# EasyEDA Pro project ProPrj_Multi-Puporse Circuit System_2026-03-19.epro, board PCB1
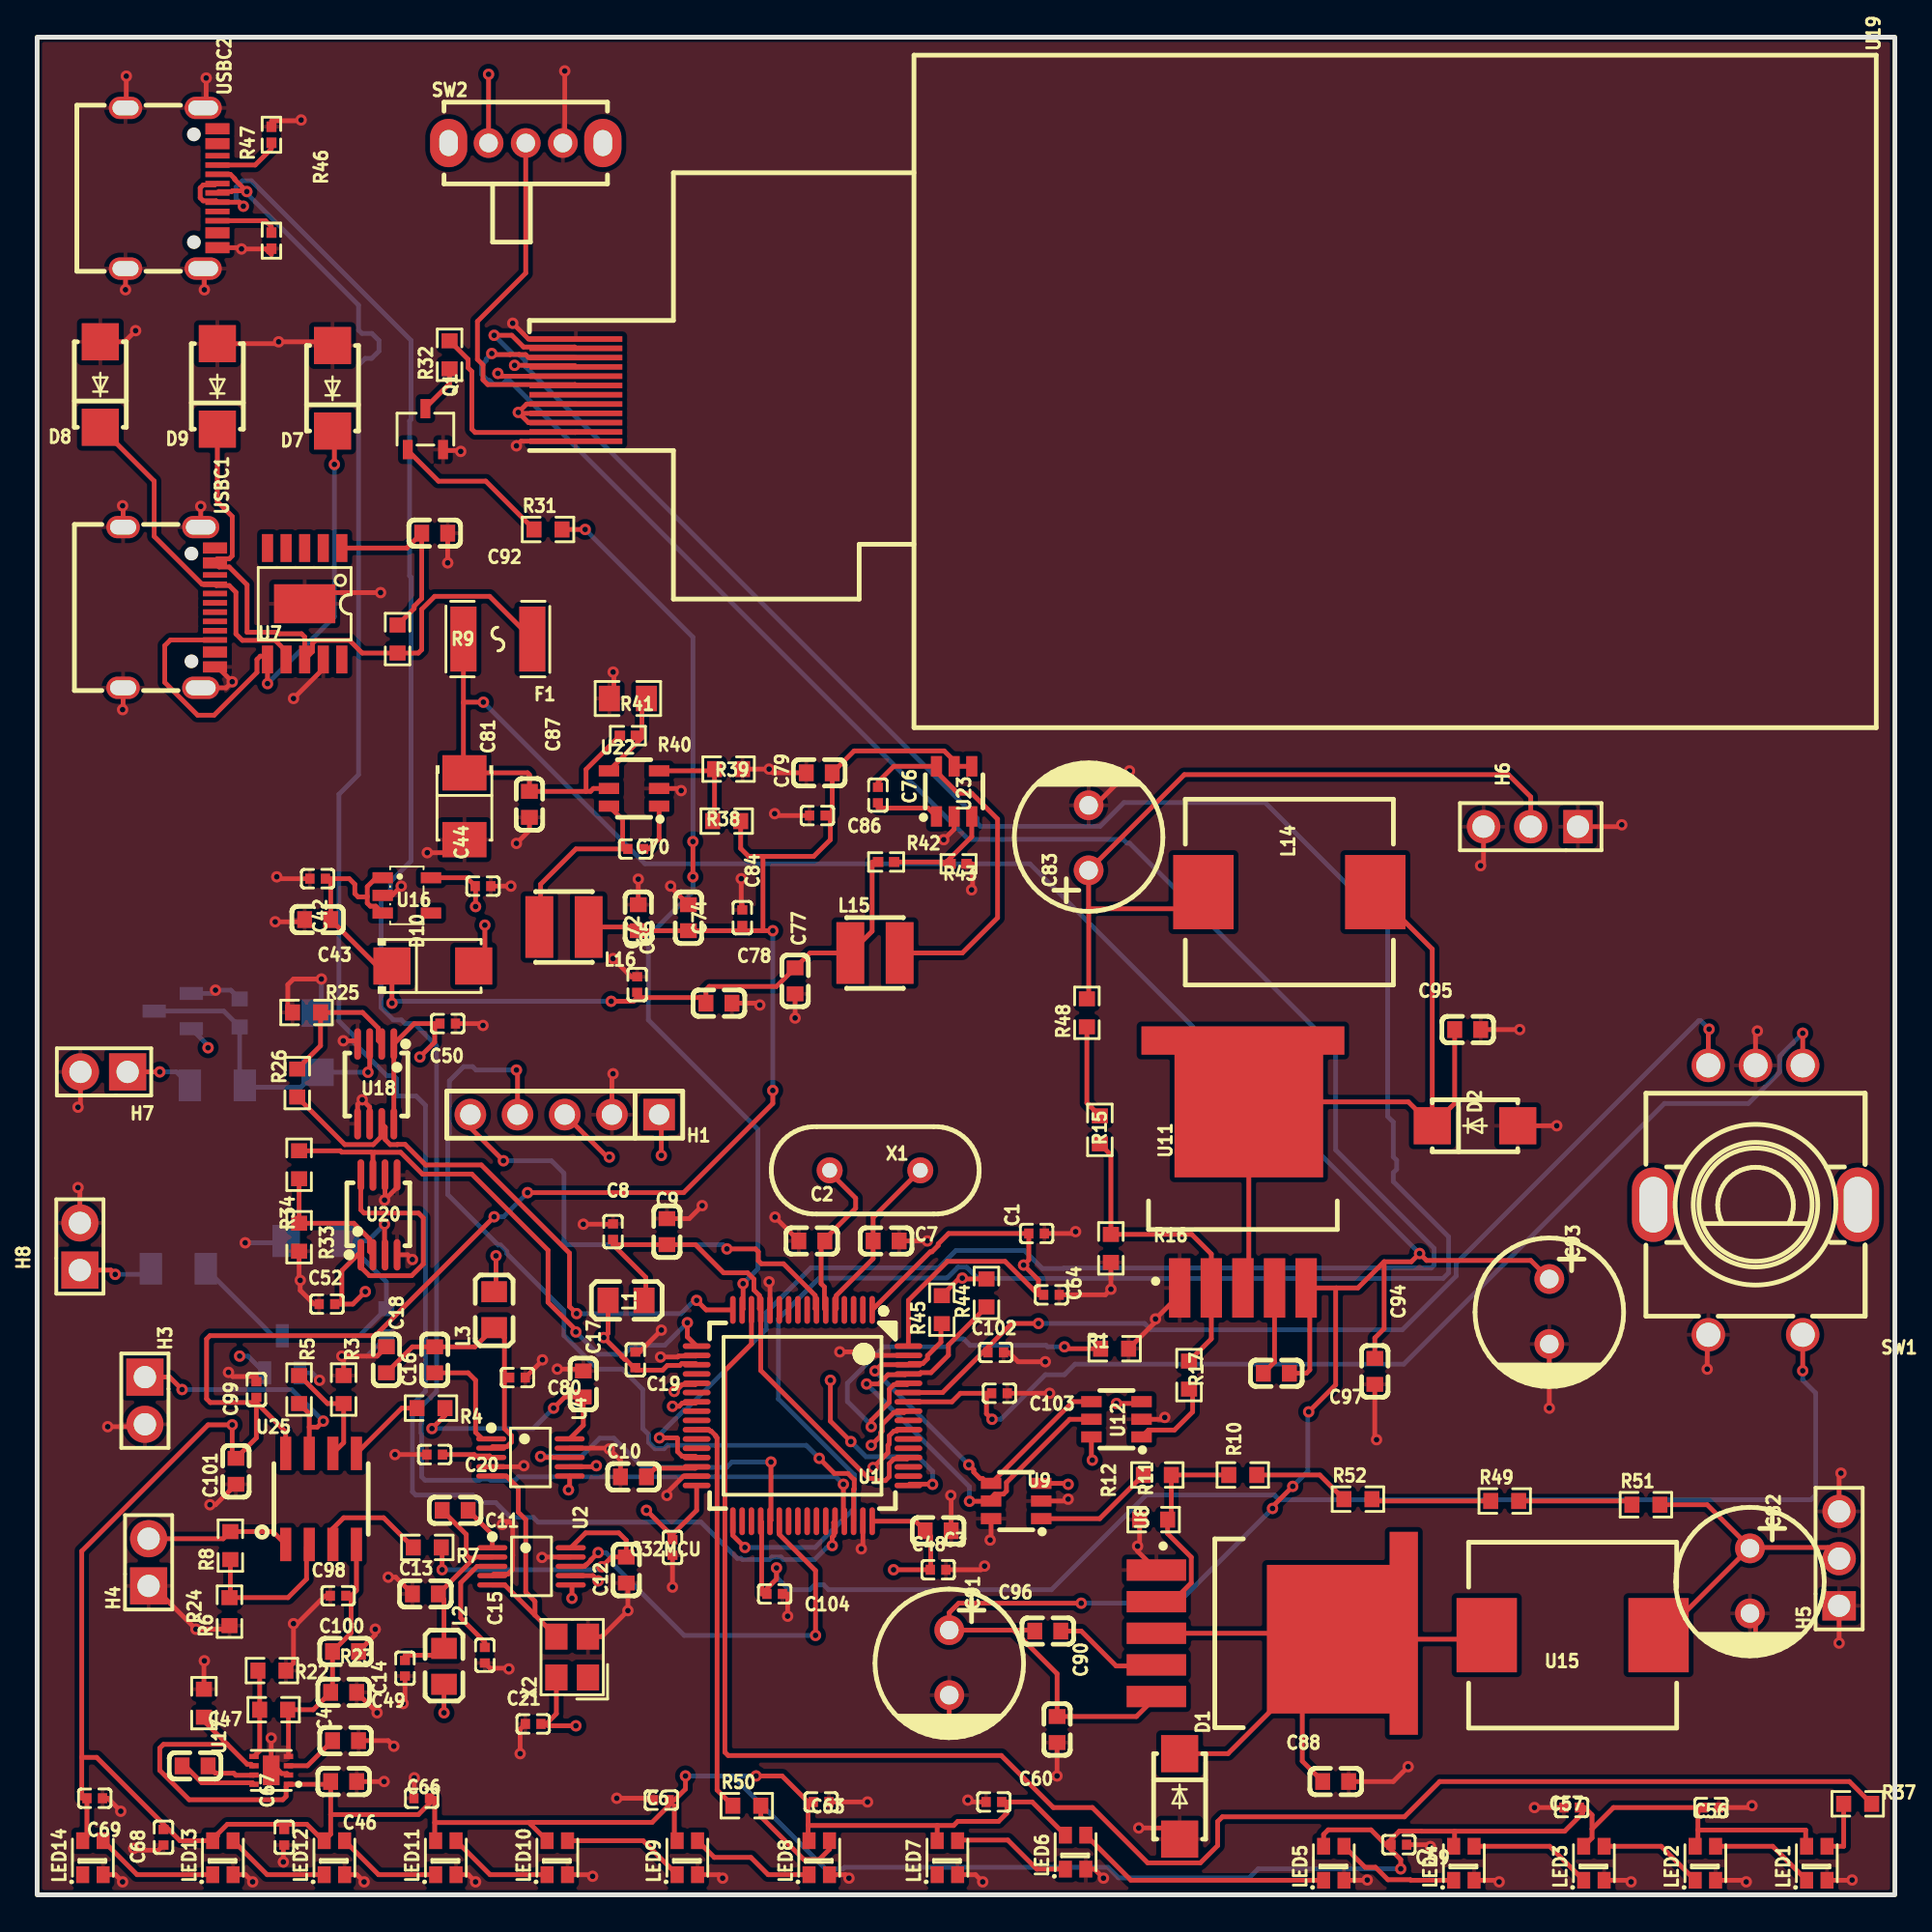
[diagram p1: board, top side]
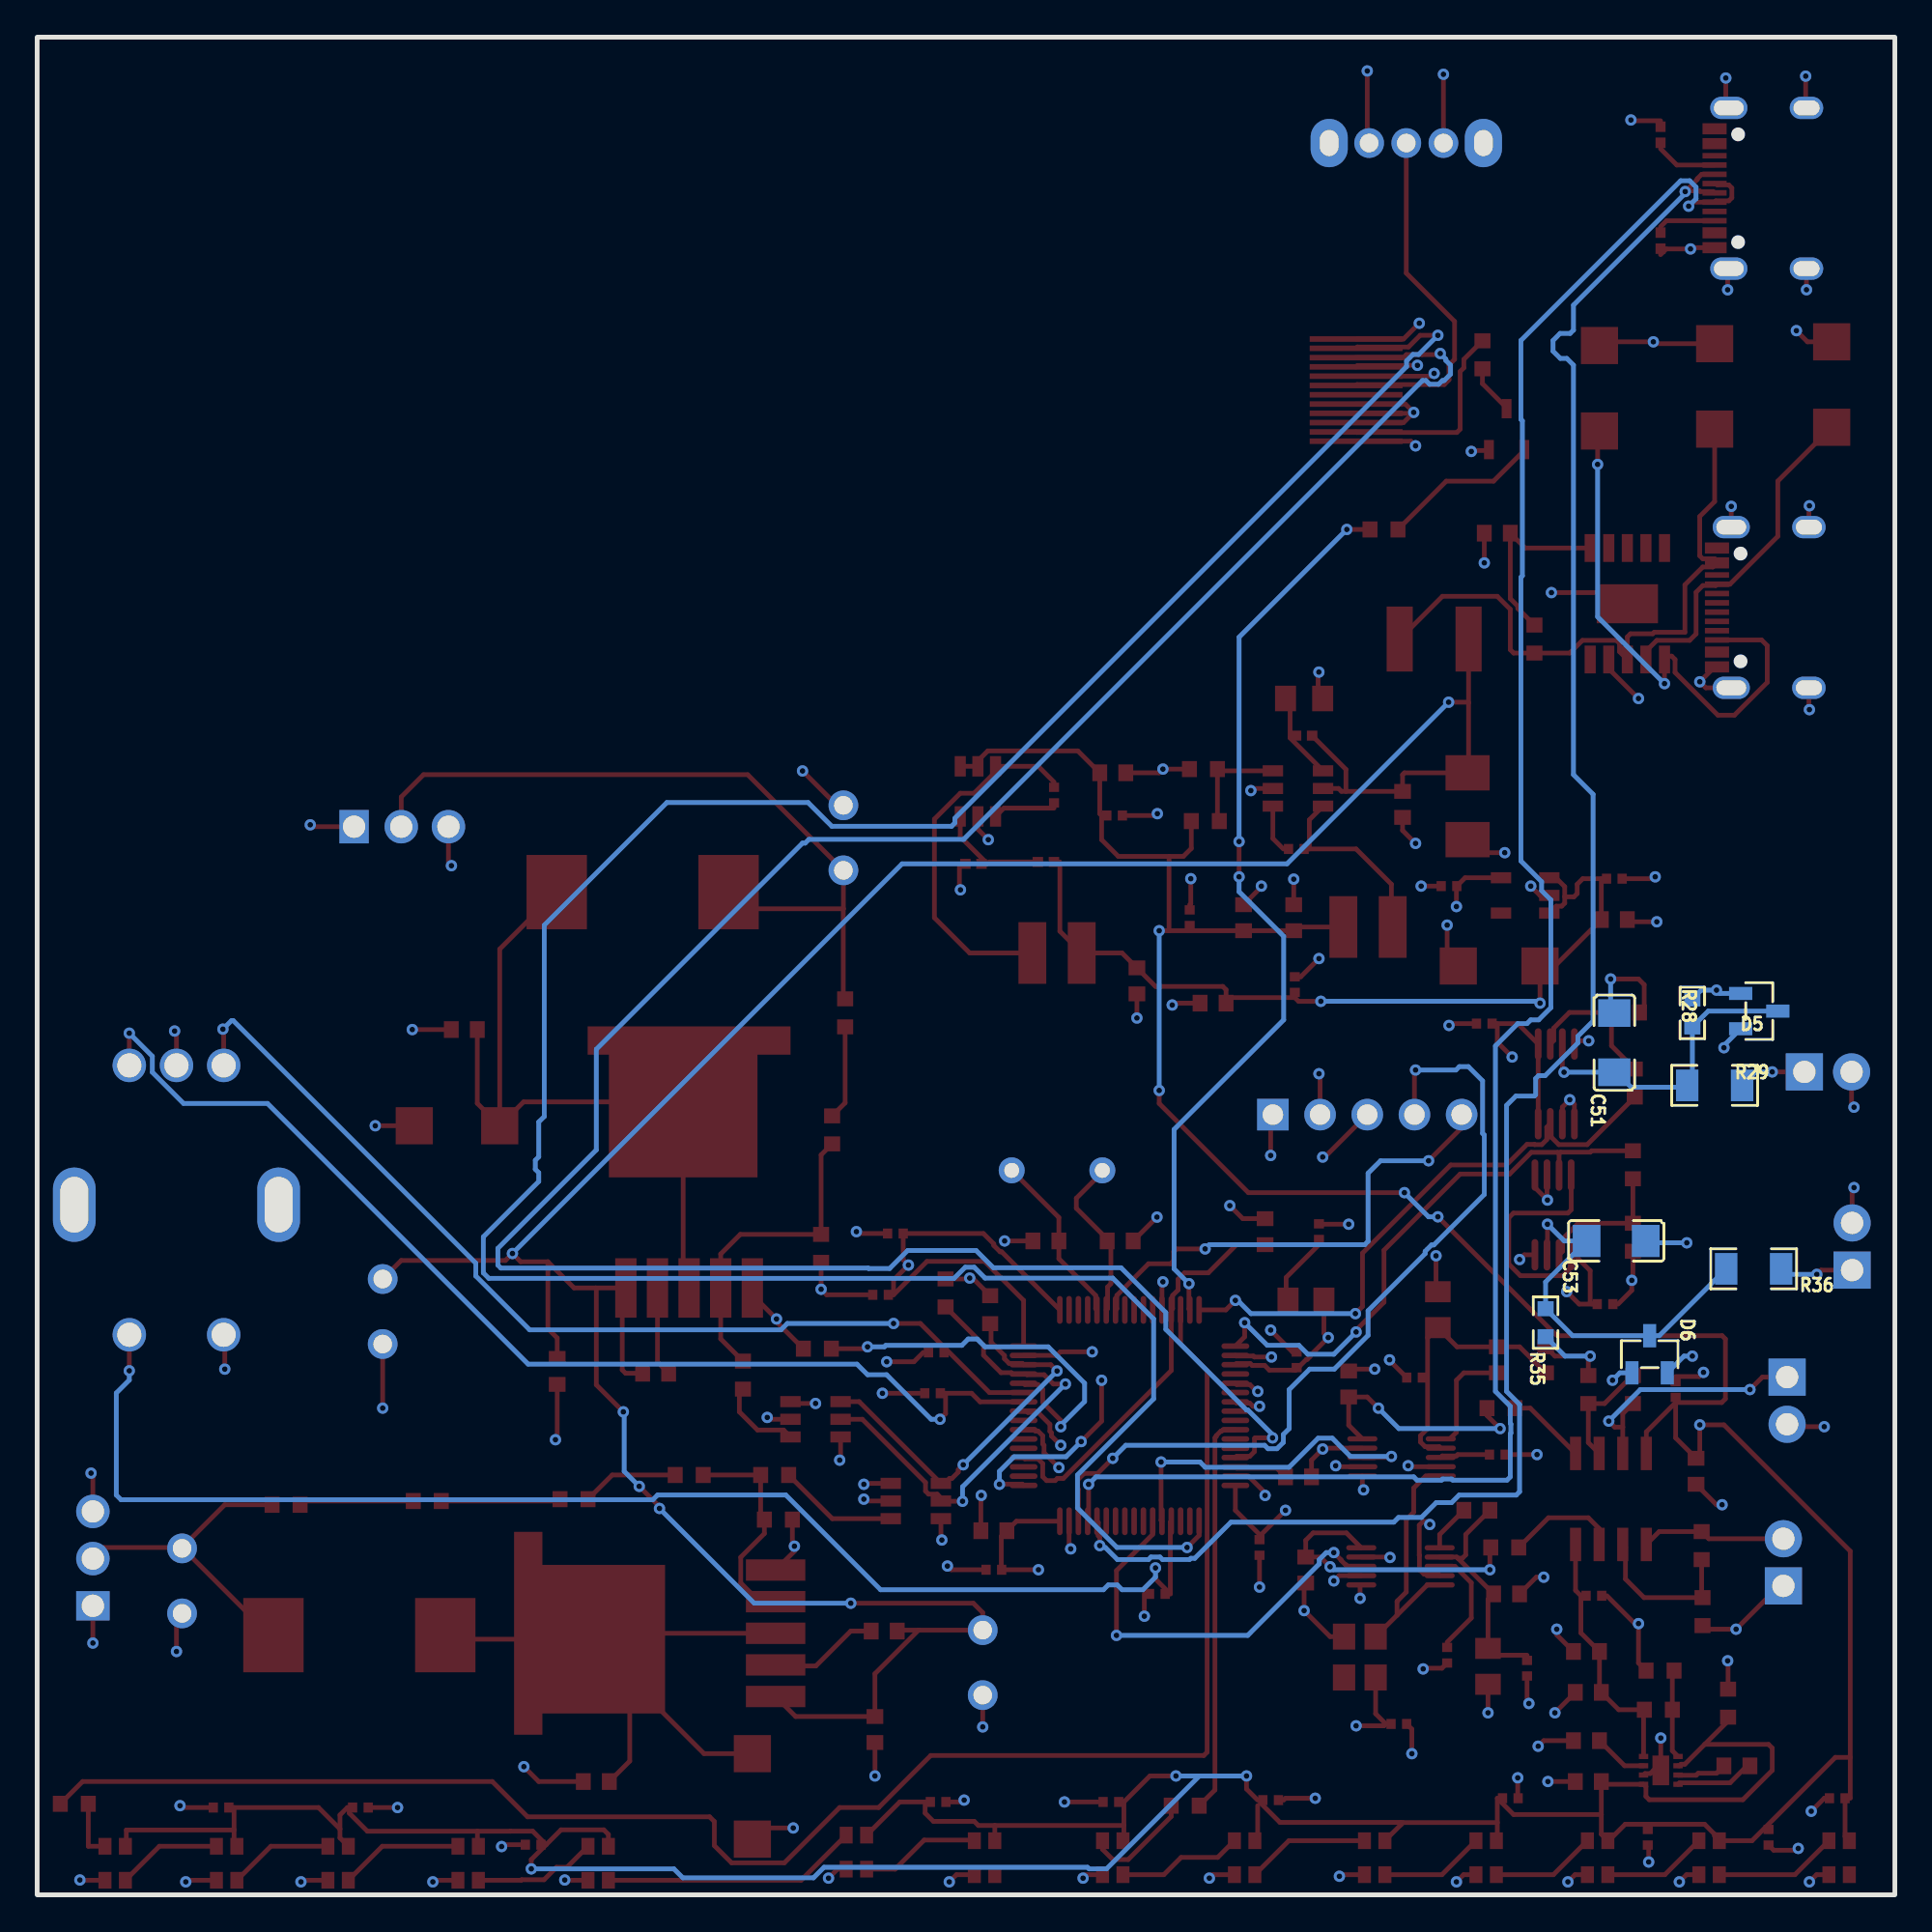
[diagram p2: board, bottom side, seen from below]

Outline 100 x 100 mm; copper layers: Top Layer, Inner1, Inner2, Bottom Layer. Coordinates in mm from the lower left corner of the outline.
Outline path: rectangle 0,0 100,100
Stack: Top Layer 0.035mm Outer layer thickness 1oz / Dielectric1 0.2104mm 7628 RC49% 8.6mil / Inner1 0.0152mm Inner layer thickness / Dielectric2 1.065mm 1.1mm H/HOZ Copper / Inner2 0.0152mm Inner layer thickness / Dielectric3 0.2104mm 7628 RC49% 8.6mil / Bottom Layer 0.035mm Outer layer thickness 1oz

## Design rules (mm)
template: 自定义配置
spacing copperThickness1oz (default): track to track 0.152, other pairs 0.152 to 0.3
spacing copperThickness2oz: track to track 0.203, other pairs 0.152 to 0.3
track width copperThickness1oz (default): min 0.127, default 0.254, max 2.54
track width copperThickness2oz: min 0.203, default 0.254, max 2.54
differential pair differentialPair (default): width min 0.127, default 0.254, max 2.54; gap min 0.152, default 0.152
via viaSize (default): diameter min 0.5, default 0.61, max 10; hole min 0.3, default 0.305, max 6.3

## Placement (name value [footprint] x y rotation side)
C1  100nF  [C0402]  53.8 35.6 0 top
C2  22pF  [C0603]  41.7 35.2 0 top
C3  4.7uF  [C0603]  48.5 19.6 180 top
C4  4.7uF  [C0603]  16.6 8.3 180 top
C6  100nF  [C0402]  33.6 5.1 0 top
C7  22pF  [C0603]  45.7 35.2 180 top
C8  100nF  [C0402]  31 35.7 90 top
C9  1uF  [C0603]  33.9 35.7 90 top
C10  2.2uF  [C0603]  32.1 22.5 0 top
C11  10nF  [C0603]  22.5 20.7 180 top
C12  22pF  [C0603]  31.71 17.48 90 top
C13  10uF  [C0603]  20.9 16.2 0 top
C14  100nF  [C0402]  19.8 12.2 90 top
C15  100nF  [C0402]  24.1 12.9 270 top
C16  10nF  [C0603]  21.4 28.8 90 top
C17  22pF  [C0603]  29.4 27.5 270 top
C18  10uF  [C0603]  18.8 28.8 270 top
C19  100nF  [C0402]  32.2 28.8 90 top
C20  100nF  [C0402]  21.4 23.7 180 top
C21  100nF  [C0402]  26.7 9.2 0 top
C32MCU  100nF  [C0402]  34.2 18.7 270 top
C42  100nF  [C0402]  15.1 54.7 180 top
C43  1uF  [C0603]  15.1 52.5 180 top
C44  1uF  [C0402]  24 54.3 0 top
C46  4.7uF  [C0603]  16.5 6.1 180 top
C47  1uF  [C0603]  8.5 6.94 0 top
C48  100nF  [C0402]  48.5 17.5 0 top
C49  2.2uF  [C0603]  16.5 10.9 180 top
C50  100nF  [C0402]  22.1 46.9 180 top
C51  100nF  [C1206]  15.1 45.87 90 bottom
C52  100nF  [C0402]  15.6 31.8 0 top
C53  100nF  [C1206]  15 35.2 180 bottom
C56  100nF  [C0402]  90.1 4.7 180 top
C57  100nF  [C0402]  82.6 4.7 0 top
C59  100nF  [C0402]  73.3 2.7 180 top
C60  100nF  [C0402]  51.5 5 0 top
C63  100nF  [C0402]  42.2 5 180 top
C64  100nF  [C0402]  54.6 32.3 0 top
C66  100nF  [C0402]  20.7 5.2 0 top
C67  100nF  [C0402]  13.3 3.1 90 top
C68  100nF  [C0402]  6.8 3.1 90 top
C69  100nF  [C0402]  3.1 5.2 180 top
C70  100nF  [C0402]  32.22 56.3 0 top
C72  22pF  [C0603]  32.36 52.6 90 top
C74  22uF  [C0603]  35.06 52.6 270 top
C76  100nF  [C0402]  45.26 59.2 270 top
C77  22pF  [C0603]  40.8 49.2 270 top
C78  22uF  [C0603]  36.7 48 180 top
C79  4.7uF  [C0603]  42.1 60.4 180 top
C80  100nF  [C0402]  25.85 27.85 180 top
C81  4.7uF  [CAP-SMD_L3.5-W2.8-FD]  23 58.6 270 top
C82  330uF  [CAP-TH_BD8.0-P3.50-D0.6-FD]  92.2 16.9 270 top
C83  330uF  [CAP-TH_BD8.0-P3.50-D0.6-FD]  56.6 56.9 90 top
C84  100nF  [C0402]  37.96 52.6 270 top
C85  100nF  [C0402]  32.3 49 270 top
C86  100nF  [C0402]  42 58.1 180 top
C87  100nF  [C0603]  26.5 58.7 270 top
C88  1uF  [C0603]  69.9 6.1 0 top
C90  1uF  [C0603]  54.9 8.9 270 top
C91  220uF  [CAP-TH_BD8.0-P3.50-D0.6-FD]  49.1 12.5 270 top
C92  1uF  [C0603]  21.4 73.3 180 top
C93  220uF  [CAP-TH_BD8.0-P3.50-D0.6-FD]  81.4 31.4 270 top
C94  1uF  [C0603]  72.01 28.18 270 top
C95  1uF  [C0603]  77.01 46.58 0 top
C96  1uF  [C0603]  54.4 14.2 0 top
C97  1uF  [C0603]  66.71 28.08 180 top
C98  100nF  [C0402]  16.2 16.1 0 top
C99  100nF  [C0402]  11.8 27.2 90 top
C100  4.7uF  [C0603]  16.6 13.1 0 top
C101  4.7uF  [C0603]  10.7 22.8 90 top
C102  100nF  [C0402]  51.6 29.2 0 top
C103  100nF  [C0402]  51.8 27 180 top
C104  100nF  [C0402]  39.7 16.2 180 top
D1  B250AF-13  [DO-214AC_L4.3-W2.7-LS5.3-RD]  61.5 5.3 270 top
D2  B250AF-13  [DO-214AC_L4.3-W2.7-LS5.3-RD]  77.4 41.4 0 top
D5  BAV99  [SOT-23-3_L2.9-W1.3-P1.90-LS2.4-BR]  7.3 47.57 0 bottom
D6  BAV99  [SOT-23-3_L2.9-W1.3-P1.90-LS2.4-BR]  13.2 29.1 270 bottom
D7  B250AF-13  [DO-214AC_L4.3-W2.7-LS5.3-RD]  15.9 81.1 90 top
D8  B250AF-13  [DO-214AC_L4.3-W2.7-LS5.3-RD]  3.4 81.3 90 top
D9  B250AF-13  [DO-214AC_L4.3-W2.7-LS5.3-RD]  9.7 81.2 90 top
D10  SS14  [SMA_L4.3-W2.6-LS5.1-RD]  21.3 50 0 top
F1  JK-MSMD110-24V  [F1812]  24.8 67.6 180 top
H1  2.54-1*5  [HDR-TH_5P-P2.54-V-M]  28.4 42 180 top
H3  HX PH254-01-02-Z-L11.5 male header connector  [HDR-TH_2P-P2.54-V-M]  5.8 26.6 270 top
H4  HX PH254-01-02-Z-L11.5 male header connector  [HDR-TH_2P-P2.54-V-M]  6 17.9 90 top
H5  HX PH254-01-03-Z-L11.5 pcb pin header  [HDR-TH_3P-P2.54-V-M-1]  97 18.1 90 top
H6  HX PH254-01-03-Z-L11.5 pcb pin header  [HDR-TH_3P-P2.54-V-M-1]  80.4 57.5 180 top
H7  HX PH254-01-02-Z-L11.5 male header connector  [HDR-TH_2P-P2.54-V-M]  3.6 44.3 180 top
H8  HX PH254-01-02-Z-L11.5 male header connector  [HDR-TH_2P-P2.54-V-M]  2.3 34.9 90 top
L1  HCB2012KV-601T20  [L0805]  31.7 32 180 top
L2  HCB2012KV-601T20  [L0805]  21.9 12.3 270 top
L3  HCB2012KV-601T20  [L0805]  24.6 31.5 90 top
L14  47uH  [IND-SMD_L11.0-W10.2_CXP1050]  67.41 53.98 0 top
L15  10uH  [IND-SMD_L3.0-W3.0]  45.1 50.7 0 top
L16  10uH  [IND-SMD_L3.0-W3.0]  28.36 52.1 180 top
LED1  WS2812B-2020  [LED-SMD_4P-L2.0-W2.0-TL_WS2812B-2020]  95.8 1.7 90 top
LED2  WS2812B-2020  [LED-SMD_4P-L2.0-W2.0-TL_WS2812B-2020]  89.8 1.7 90 top
LED3  WS2812B-2020  [LED-SMD_4P-L2.0-W2.0-TL_WS2812B-2020]  83.8 1.7 90 top
LED4  WS2812B-2020  [LED-SMD_4P-L2.0-W2.0-TL_WS2812B-2020]  76.8 1.7 90 top
LED5  WS2812B-2020  [LED-SMD_4P-L2.0-W2.0-TL_WS2812B-2020]  69.8 1.7 90 top
LED6  WS2812B-2020  [LED-SMD_4P-L2.0-W2.0-TL_WS2812B-2020]  55.9 2.3 90 top
LED7  WS2812B-2020  [LED-SMD_4P-L2.0-W2.0-TL_WS2812B-2020]  49 2 90 top
LED8  WS2812B-2020  [LED-SMD_4P-L2.0-W2.0-TL_WS2812B-2020]  42.1 2 90 top
LED9  WS2812B-2020  [LED-SMD_4P-L2.0-W2.0-TL_WS2812B-2020]  35 2 90 top
LED10  WS2812B-2020  [LED-SMD_4P-L2.0-W2.0-TL_WS2812B-2020]  28 2 90 top
LED11  WS2812B-2020  [LED-SMD_4P-L2.0-W2.0-TL_WS2812B-2020]  22 2 90 top
LED12  WS2812B-2020  [LED-SMD_4P-L2.0-W2.0-TL_WS2812B-2020]  16 2 90 top
LED13  WS2812B-2020  [LED-SMD_4P-L2.0-W2.0-TL_WS2812B-2020]  10 2 90 top
LED14  WS2812B-2020  [LED-SMD_4P-L2.0-W2.0-TL_WS2812B-2020]  3 2 90 top
Q1  L2N7002SLLT1G  [SOT-23-3_L3.0-W1.7-P0.95-LS2.9-BR]  20.9 78.9 270 top
R1  10kΩ  [R0603]  58 29.4 0 top
R3  10kΩ  [R0603]  16.5 27.2 270 top
R4  10kΩ  [R0603]  21.2 26.2 180 top
R5  40kΩ  [R0603]  14.1 27.2 270 top
R6  40kΩ  [R0603]  10.35 15.25 90 top
R7  10kΩ  [R0603]  21 18.7 180 top
R8  40kΩ  [R0603]  10.4 18.8 90 top
R9  1kΩ  [R0603]  19.4 67.6 90 top
R10  15kΩ  [R0603]  64.9 22.6 0 top
R11  1.2kΩ  [R0603]  60.1 20.2 0 top
R12  2.2kΩ  [R0603]  60.3 22.6 0 top
R15  15kΩ  [R0603]  57.21 41.18 90 top
R16  1.2kΩ  [R0603]  57.8 34.8 90 top
R17  2.2kΩ  [R0603]  62.01 27.98 90 top
R22  10kΩ  [R0603]  12.73 9.97 0 top
R23  32kΩ  [R0603]  12.64 12.07 180 top
R24  10kΩ  [R0603]  8.98 10.32 270 top
R25  1kΩ  [R0603]  14.5 47.5 0 top
R26  47kΩ  [R0603]  14 43.7 270 top
R28  1MΩ  [R0603]  10.9 47.47 270 bottom
R29  10kΩ  [R1206]  9.7 43.57 0 bottom
R31  1kΩ  [R0603]  27.5 73.5 0 top
R32  10Ω  [R0603]  22.2 82.9 90 top
R33  1kΩ  [R0603]  14.1 35.4 90 top
R34  47kΩ  [R0603]  14.1 39.3 90 top
R35  1MΩ  [R0603]  18.8 30.8 90 bottom
R36  10kΩ  [R1206]  7.6 33.7 0 bottom
R37  100Ω  [R0603]  98 4.9 180 top
R38  73.2kΩ  [R0603]  37.12 57.8 0 top
R39  10kΩ  [R0603]  37.22 60.6 180 top
R40  100kΩ  [R0402]  31.8 62.4 0 top
R41  25kΩ  [R0805]  31.8 64.4 180 top
R42  100kΩ  [R0402]  45.7 55.6 180 top
R43  20kΩ  [R0402]  49.6 55.5 180 top
R44  10kΩ  [R0603]  51.1 32.4 90 top
R45  10kΩ  [R0603]  48.7 31.5 90 top
R46  5.1kΩ  [R0402]  12.61 89.05 270 top
R47  5.1kΩ  [R0402]  12.61 94.75 90 top
R48  0Ω  [R0603]  56.51 47.48 90 top
R49  0Ω  [R0603]  79 21.2 0 top
R50  100Ω  [R0603]  38.2 4.8 0 top
R51  0Ω  [R0603]  86.6 21 0 top
R52  0Ω  [R0603]  71.1 21.3 0 top
SW1  EC11E15244B2  [SW-TH_EC11XXXXXXXX]  92.5 37.4 180 top
SW2  SK12D07VG3  [SW-TH_SK12D07VG3]  26.3 94.3 0 top
U1  STM32F401RET6  [LQFP-64_L10.0-W10.0-P0.50-LS12.0-BL]  41.2 25.8 180 top
U2  AD9833BRMZ-REEL7  [MSOP-10_L3.0-W3.0-P0.50-LS5.0-BL]  26.61 17.68 270 top
U4  AD9833BRMZ-REEL7  [MSOP-10_L3.0-W3.0-P0.50-LS5.0-BL]  26.55 23.55 270 top
U7  CH224K  [ESSOP-10_L4.9-W3.9-P1.0-LS6.0-TL-EP]  14.4 69.5 180 top
U8  XL4015E1  [TO-263-5_L10.2-W8.9-P1.70-TL]  65.26 14.08 0 top
U9  MCP4725A1T-E/CH  [SOT-23-6_L2.9-W1.6-P0.95-LS2.8-BR]  52.7 21.2 0 top
U11  XL4015E1  [TO-263-5_L10.2-W8.9-P1.70-TL]  64.91 37.68 90 top
U12  MCP4725A1T-E/CH  [SOT-23-6_L2.9-W1.6-P0.95-LS2.8-BR]  58.1 25.6 0 top
U15  47uH  [IND-SMD_L11.0-W10.2_CXP1050]  82.66 13.98 180 top
U16  LP5907MFX-3.3  [SOT-23-5_L3.0-W1.7-P0.95-LS2.8-BR]  19.9 53.8 180 top
U17  LM27761DSGR  [WSON-8_L2.0-W2.0-P0.65-BL-EP]  12.6 6.7 90 top
U18  ADCMP602BRMZ  [MSOP-8_L3.0-W3.0-P0.65-LS5.0-BL]  18.22 43.66 180 top
U19  HS20HS072RX  [OLED-SMD_HS20HS072RX]  29 81 270 top
U20  ADCMP602BRMZ  [MSOP-8_L3.0-W3.0-P0.65-LS5.0-BL]  18.4 36.6 0 top
U22  SY8201CABC  [SOT-23-6_L2.9-W1.6-P0.95-LS2.8-BR]  32.13 59.56 0 top
U23  SY8201CABC  [SOT-23-6_L2.9-W1.6-P0.95-LS2.8-BR]  49.36 59.4 270 top
U25  TSH22IDT  [SO-8_L4.9-W3.9-P1.27-LS6.0-BL]  15.28 21.31 0 top
USBC1  TYPE-C-31-M-12  [USB-C_SMD-TYPE-C-31-M-12_1]  7.1 69.3 270 top
USBC2  TYPE-C-31-M-12  [USB-C_SMD-TYPE-C-31-M-12_1]  7.23 91.87 270 top
X1  8MHz  [CRYSTAL-TH_L11.1-W4.7]  45.1 39 0 top
X2  25MHz  [OSC-SMD_4P-L3.2-W2.5-BL-OXETDLJANF-0.032768MHZ]  28.8 12.8 90 top

## Footprints (pads in the part's own frame, mm; a bottom-side part is the same pattern mirrored in y, then rotated)
C0402
  rect 0.5x0.54 smd: 1(-0.42,0) 2(0.42,0)
C0603
  rect 0.8x0.9 smd: 1(-0.7,0) 2(0.7,0)
C1206
  rect 1.485x1.728 smd: 1(-1.593,0) 2(1.593,0)
CAP-SMD_L3.5-W2.8-FD
  rect 1.9x2.376 smd: 1(-1.798,0) 2(1.798,0)
CAP-TH_BD8.0-P3.50-D0.6-FD
  round 1.6 hole 1: 1(-1.75,0) 2(1.75,0)
CRYSTAL-TH_L11.1-W4.7
  round 1.4 hole 0.8: 1(-2.44,0) 2(2.44,0)
DO-214AC_L4.3-W2.7-LS5.3-RD
  rect 2x2 smd: 1(-2.3,0) 2(2.3,0)
ESSOP-10_L4.9-W3.9-P1.0-LS6.0-TL-EP
  rect 0.6x1.5 smd: 1(-2,-3) 2(-1,-3) 3(0,-3) 4(1,-3) 5(2,-3) 6(2,3) 7(1,3) 8(0,3) 9(-1,3) 10(-2,3)
  rect 3.3x2.1 smd: 11(0,0)
F1812
  rect 1.407x3.499 smd: 1(-1.853,0) 2(1.853,0)
HDR-TH_2P-P2.54-V-M
  rect 2x2 hole 1.2: 1(-1.27,0)
  round 2 hole 1.2: 2(1.27,0)
HDR-TH_3P-P2.54-V-M-1
  rect 1.575x1.8 hole 1.2: 1(-2.54,0)
  round 1.8 hole 1.2: 2(0,0) 3(2.54,0)
HDR-TH_5P-P2.54-V-M
  rect 1.7x1.7 hole 1.1: 1(-5.08,0)
  round 1.7 hole 1.1: 2(-2.54,0) 3(0,0) 4(2.54,0) 5(5.08,0)
IND-SMD_L3.0-W3.0
  rect 1.5x3.32 smd: 1(1.328,0) 2(-1.328,0)
IND-SMD_L11.0-W10.2_CXP1050
  rect 3.25x4 smd: 1(-4.625,0) 2(4.625,0)
L0805
  rect 1.133x1.377 smd: 1(-0.966,0) 2(0.966,0)
LED-SMD_4P-L2.0-W2.0-TL_WS2812B-2020
  rect 0.9x0.7 smd: 1(-0.915,0.55) 2(-0.915,-0.55) 3(0.915,-0.55) 4(0.915,0.55)
LQFP-64_L10.0-W10.0-P0.50-LS12.0-BL
  oval 0.3x1.5 smd: 1(-3.75,-5.688) 2(-3.25,-5.688) 3(-2.75,-5.688) 4(-2.25,-5.688) 5(-1.75,-5.688) 6(-1.25,-5.688) 7(-0.75,-5.688) 8(-0.25,-5.688) 9(0.25,-5.688) 10(0.75,-5.688) 11(1.25,-5.688) 12(1.75,-5.688) 13(2.25,-5.688) 14(2.75,-5.688) 15(3.25,-5.688) 16(3.75,-5.688) 33(3.75,5.688) 34(3.25,5.688) 35(2.75,5.688) 36(2.25,5.688) 37(1.75,5.688) 38(1.25,5.688) 39(0.75,5.688) 40(0.25,5.688) 41(-0.25,5.688) 42(-0.75,5.688) 43(-1.25,5.688) 44(-1.75,5.688) 45(-2.25,5.688) 46(-2.75,5.688) 47(-3.25,5.688) 48(-3.75,5.688)
  oval 1.5x0.3 smd: 17(5.7,-3.738) 18(5.7,-3.238) 19(5.7,-2.738) 20(5.7,-2.238) 21(5.7,-1.738) 22(5.7,-1.238) 23(5.7,-0.739) 24(5.7,-0.238) 25(5.7,0.262) 26(5.7,0.762) 27(5.7,1.262) 28(5.7,1.762) 29(5.7,2.261) 30(5.7,2.762) 31(5.7,3.261) 32(5.7,3.762) 49(-5.7,3.762) 50(-5.7,3.261) 51(-5.7,2.762) 52(-5.7,2.261) 53(-5.7,1.762) 54(-5.7,1.262) 55(-5.7,0.762) 56(-5.7,0.262) 57(-5.7,-0.238) 58(-5.7,-0.739) 59(-5.7,-1.238) 60(-5.7,-1.738) 61(-5.7,-2.238) 62(-5.7,-2.738) 63(-5.7,-3.238) 64(-5.7,-3.738)
MSOP-8_L3.0-W3.0-P0.65-LS5.0-BL
  oval 0.364x1.692 smd: 1(-0.975,-2.146) 2(-0.325,-2.146) 3(0.325,-2.146) 4(0.975,-2.146) 5(0.975,2.146) 6(0.325,2.146) 7(-0.325,2.146) 8(-0.975,2.146)
MSOP-10_L3.0-W3.0-P0.50-LS5.0-BL
  oval 0.28x1.62 smd: 1(-1,-2.11) 2(-0.5,-2.11) 3(0,-2.11) 4(0.5,-2.11) 5(1,-2.11) 6(1,2.11) 7(0.5,2.11) 8(0,2.11) 9(-0.5,2.11) 10(-1,2.11)
OLED-SMD_HS20HS072RX
  rect 0.3x5 smd: 1(-2.75,0) 2(-2.25,0) 3(-1.75,0) 4(-1.25,0) 5(-0.75,0) 6(-0.25,0) 7(0.25,0) 8(0.75,0) 9(1.25,0) 10(1.75,0) 11(2.25,0) 12(2.75,0)
OSC-SMD_4P-L3.2-W2.5-BL-OXETDLJANF-0.032768MHZ
  rect 1.4x1.2 smd: 1(-1.1,-0.85) 2(1.1,-0.85) 3(1.1,0.85) 4(-1.1,0.85)
R0402
  rect 0.566x0.54 smd: 1(-0.433,0) 2(0.433,0)
R0603
  rect 0.806x0.864 smd: 1(-0.753,0) 2(0.753,0)
R0805
  rect 1.133x1.377 smd: 1(-1,0) 2(1,0)
R1206
  rect 1.208x1.701 smd: 1(-1.479,0) 2(1.479,0)
SMA_L4.3-W2.6-LS5.1-RD
  rect 2x2 smd: 1(-2.2,0) 2(2.2,0)
SO-8_L4.9-W3.9-P1.27-LS6.0-BL
  rect 0.6x1.8 smd: 1(-1.905,-2.45) 2(-0.635,-2.45) 3(0.635,-2.45) 4(1.905,-2.45) 5(1.905,2.45) 6(0.635,2.45) 7(-0.635,2.45) 8(-1.905,2.45)
SOT-23-3_L2.9-W1.3-P1.90-LS2.4-BR
  rect 1.25x0.7 smd: 1(1,-0.95) 2(1,0.95) 3(-1,0)
SOT-23-3_L3.0-W1.7-P0.95-LS2.9-BR
  rect 1.038x0.532 smd: 1(1.101,-0.95) 2(1.101,0.95) 3(-1.101,0)
SOT-23-5_L3.0-W1.7-P0.95-LS2.8-BR
  rect 1.1x0.6 smd: 1(1.3,-0.95) 2(1.3,0) 3(1.3,0.95) 4(-1.3,0.95) 5(-1.3,-0.95)
SOT-23-6_L2.9-W1.6-P0.95-LS2.8-BR
  rect 1.1x0.6 smd: 1(1.35,-0.95) 2(1.35,0) 3(1.35,0.95) 4(-1.35,0.95) 5(-1.35,0) 6(-1.35,-0.95)
SW-TH_EC11XXXXXXXX
  oval 2.3x4 hole 1.5x3: 6(5.5,0.25) 7(-5.5,0.25)
  round 1.8 hole 1.3: A(-2.54,-7.25) B(2.54,-7.25) C(0,-7.25) D(-2.54,7.25) E(2.54,7.25)
SW-TH_SK12D07VG3
  oval 1.6x1.6 hole 1: 1(-2,0) 2(0,0) 3(2,0)
  oval 2x2.6 hole 1x1.4: 4(4.15,0) 5(-4.15,0)
TO-263-5_L10.2-W8.9-P1.70-TL
  rect 3.2x1.15 smd: 1(-5.008,3.404) 2(-5.008,1.702) 3(-5.008,0) 4(-5.008,-1.702) 5(-5.008,-3.404)
  custom 8.128x10.922 smd: 6(5.008,-0.318)
USB-C_SMD-TYPE-C-31-M-12_1
  oval 1.2x2 hole 0.8x1.6: 1(4.325,1.706) 4(-4.325,1.706)
  oval 1.2x1.8 hole 0.8x1.4: 2(4.325,-2.474) 3(-4.325,-2.474)
  custom 0.6x1.3 smd: A1B12(-3.2,2.474) A4B9(-2.4,2.474) B1A12(3.2,2.474) B4A9(2.401,2.474)
  rect 0.3x1.3 smd: A5(-1.25,2.474) A6(-0.25,2.474) A7(0.25,2.474) A8(1.25,2.474) B5(1.75,2.474) B6(0.75,2.474) B7(-0.75,2.474) B8(-1.75,2.474)
WSON-8_L2.0-W2.0-P0.65-BL-EP
  rect 0.28x0.505 smd: 1(-0.75,-0.927) 2(-0.25,-0.927) 3(0.25,-0.927) 4(0.75,-0.927) 5(0.75,0.927) 6(0.25,0.927) 7(-0.25,0.927) 8(-0.75,0.927)
  rect 1.6x0.9 smd: 9(0,0)

## Nets
As in the schematic, except:
+3.3V: C1.1 C3.2 C19.1 C21.2 C32MCU.1 C44.1 C48.1 C50.2 C52.2 C64.1 D5.2 D6.2 D10.2 H1.1 L1.2 L2.2 L3.2 R44.2 R45.2 SW2.1 U1.1 U1.19 U1.32 U1.48 U1.64 U9.3 U12.3 U12.6 U16.5 U18.1 U18.8 U19.8 U19.9 U19.10 U20.1 U20.8 X2.4
GND: C1.2 C2.1 C3.1 C4.1 C6.1 C7.1 C8.2 C9.2 C10.1 C12.1 C13.1 C14.1 C15.2 C17.1 C18.1 C19.2 C20.2 C21.1 C32MCU.2 C42.2 C43.2 C44.2 C46.1 C48.2 C49.1 C50.1 C51.2 C52.1 C53.2 C56.1 C57.1 C59.1 C60.1 C63.1 C64.2 C66.1 C67.1 C68.1 C69.1 C72.2 C74.1 C77.2 C78.1 C79.2 C80.1 C81.2 C82.2 C83.2 C84.1 C85.1 C86.2 C87.2 C88.2 C90.2 C91.2 C92.1 C93.2 C94.2 C95.2 C98.1 C99.2 C100.2 C101.1 C102.2 C103.1 C104.1 D1.2 D2.2 D5.1 D6.1 D7.2 D8.2 D9.2 H1.2 H3.2 H4.1 H5.1 H5.3 H6.1 H6.3 H7.2 H8.2 LED1.2 LED2.2 LED3.2 LED4.2 LED5.2 LED6.2 LED7.2 LED8.2 LED9.2 LED10.2 LED11.2 LED12.2 LED13.2 LED14.2 Q1.2 R1.2 R3.1 R6.1 R11.1 R16.1 R23.1 R24.1 R25.1 R28.1 R33.1 R35.1 R39.1 R41.2 R43.1 R46.2 R47.2 SW1.C SW1.E SW2.3 U1.12 U1.18 U1.31 U1.47 U1.63 U2.4 U2.9 U4.4 U4.9 U7.9 U7.11 U8.1 U9.2 U9.6 U11.1 U12.2 U16.2 U17.2 U17.9 U18.4 U18.5 U18.6 U19.1 U19.12 U20.4 U20.5 U20.6 U22.2 U23.2 USBC1.1 USBC1.2 USBC1.3 USBC1.4 USBC1.B1A12 USBC2.1 USBC2.2 USBC2.3 USBC2.4 USBC2.B1A12 X2.2
$1N4931: H4.2 R8.2 U25.1

Pads without a net: LED14 1; SW1 6 7; SW2 4 5; U1 3 4 8 9 10 11 20 22 24 25 27 34 35 39 40 41 42 43 50 51 53 54 56; U7 2 3 4 5 10; U16 4; U19 7; USBC1 A1B12 A6 A7 A8 B4A9 B6 B7 B8; USBC2 A1B12 A4B9 A8 B4A9 B8; X2 1

## Via types
v1: diameter 0.61, hole 0.305, Top Layer to Bottom Layer, 235 vias

## Routing (per net, layer and track width the routed paths; a pad name or vN(x,y) marks a point on that pad's centre or on a via; arc(x,y) is an arc through that point)
3.7VBAD: length 46
  Top Layer w0.254: v1(19.1,48) D10.1 18.3,50 C43.1 15.8,54.7 16.8,54.7 17.1,54.4 17.1,53.9 17.28,53.72 17.75,53.72 17.77,53.74 ; v1(30.9,48.1) 32.1,48.1 32.3,48.3 35.7,48.3 C78.2 36,48.72 36.18,48.9 39.8,48.9 C77.1 41.6,50.7 L15.2 44.95,51.87 44.95,55.6 ; U16.3 18.23,53.22 17.93,53.22 17.77,53.38 17.77,53.74 ; 17.77,53.74 17.77,54.27 18.25,54.75 U16.1
  Bottom Layer w0.254: v1(19.1,48) 19.2,48.1 v1(30.9,48.1)
+3.3V: length 111.4
  Top Layer w0.254: v1(58.1,26.45) 59.35,26.45 U12.3 ; U1.48 47.29,20.11 C3.2 48.1,19.3 48.1,17.5 v1(46.1,17.5) ; v1(33.6,39.8) 33.6,41.88 H1.1 ; R45.2 49.65,33.2 v1(49.8,33.2) 49.85,33.15 R44.2 ; 17.42,38.75 17.42,38.74 17.42,36.88 17.6,36.7 20.53,36.7 20.78,36.45 20.78,33.96 20.16,33.33 17.88,33.33 17.42,33.79 17.42,34.44 17.42,34.45 17.42,34.45 17.25,34.45 16.4,33.6 16.4,31.9 16.3,31.8 16.99,31.8 v1(17.67,32.47) ; v1(56.8,23.4) 56.75,23.45 U12.6 ; v1(29,9.1) 27.5,9.1 27.4,9.2 27.95,9.75 X2.4 ; U1.32 35.5,20.7 34.2,19.4 34.1,19.4 v1(32.8,20.7) ; L2.2 v1(21.9,9.8) ; U19.10 26.45,79.25 25.95,79.75 ; v1(20.6,45.1) 21.4,45.9 21.4,46.9 20.3,46.9 U18.1 U18.8 ; v1(55.5,22.1) 55.45,22.15 U9.3 ; D10.2 24.1,50.6 v1(24.1,52.2) ; U1.1 48.08,34.62 48.16,34.62 48.5,34.96 48.5,35.04 49.06,35.6 C1.1 53.38,34.18 v1(53.1,33.9) 53.9,33.1 53.9,32.3 52.1,34.1 49,34.1 46.9,32 U1.64 ; U19.8 26.35,80.25 v1(25.9,79.8) 25.95,79.75 ; v1(23.6,53.2) 23.6,54.28 C44.1 23.13,54.75 U16.5 ; L3.2 24.7,32.57 v1(24.7,34.4) ; U19.9 25.95,79.75 ; U1.19 35.44,28.6 34.7,28.6 34.6,28.5 33.93,28.5 33.67,28.25 32.25,28.25 31.68,28.82 31.63,28.82 31.47,28.98 31.47,29.03 v1(30.5,30) 30.73,30.23 L1.2 ; SW2.1 v1(24.3,98)
  Bottom Layer w0.254: v1(10.9,29) 11.35,29 D6.2 ; D5.2 9.2,45.72 v1(9.2,45.6)
+5V: length 284.6
  Top Layer w0.254: 26.59,3.77 LED10.4 ; 26.59,3.77 26.59,3.9 33.1,3.9 34.15,4.95 ; 26.59,3.77 26.47,3.89 21.4,3.89 ; LED11.4 21.4,2.97 21.4,3.89 ; 48.45,3.73 49.33,3.73 49.56,3.96 51.76,3.96 52.2,4.4 52.2,5 53.56,5 LED6.4 ; 48.45,3.73 41.52,3.73 41.5,3.75 ; 48.45,3.73 LED7.4 ; 21.4,3.89 21.4,5.2 20.52,4.32 15.8,4.32 ; 89.4,3.51 89.4,4.7 84.86,4.7 83.7,3.54 ; 89.4,3.51 89.4,2.76 89.25,2.62 ; 89.4,3.51 89.42,3.49 95.2,3.49 95.2,2.62 95.25,2.62 ; v1(26.4,37.8) 34.8,37.8 39.6,42.6 v1(39.6,43.3) ; 2.4,7.4 3.2,7.4 7.69,2.91 LED13.4 9.7,3.17 9.7,3.26 10.24,3.8 14.52,3.8 15.4,2.91 LED12.4 15.8,3.26 15.8,4.32 ; 2.4,7.4 2.4,5.21 2.67,5.21 C69.2 2.68,3.15 LED14.4 ; 2.4,7.4 2.4,18.5 9.2,25.3 v1(10.5,25.3) 10.5,23.7 C101.2 11.8,24.6 11.8,26.5 ; 41.45,2.91 41.5,2.91 41.5,3.75 ; 39.07,51.9 C74.2 C72.1 32.16,52.1 L16.2 ; 39.07,51.9 v1(39.6,51.9) ; 39.07,51.9 39.07,55.9 ; 83.25,2.62 83.7,3.06 83.7,3.54 ; v1(38.7,6.4) 40.1,6.4 41.5,5 41.5,3.75 ; 15.8,4.32 C46.2 15.65,5.95 U17.1 13.4,5.82 13.4,5.3 13.22,5.12 8.18,5.12 6.6,6.7 6.6,7.9 6.8,8.1 10.24,8.1 ; v1(24.6,36.5) 18.28,30.18 18.23,30.18 18.16,30.1 9.3,30.1 9.12,29.92 9.12,26.7 9.32,26.5 11.8,26.5 ; 11.8,26.5 13.38,24.92 U25.8 ; 72.6,2.7 71.8,3.5 69.5,3.5 69.25,3.25 69.25,2.62 ; 72.6,2.7 73.33,3.43 74.52,3.43 74.52,3.43 76.3,3.43 ; 72.6,2.7 73.4,1.9 v1(73.4,1.4) ; LED9.4 34.3,2.91 34.3,4.8 ; 83.7,3.54 83.7,4.3 83.3,4.7 83.2,4.6 83.2,4.4 82.23,3.43 76.3,3.43 ; 76.3,3.43 76.3,2.62 76.25,2.62 ; 10.24,8.1 11.3,7.03 11.51,7.03 11.59,6.95 U17.6 ; 10.24,8.1 8.98,9.36 R24.2 ; 39.07,55.9 38.3,55.9 37.87,56.33 R38.2 ; 39.07,55.9 41.8,55.9 42.7,56.8 42.7,58.1 42.8,58.2 C79.1 43.98,61.58 48.83,61.58 49.36,61.04 U23.5 U23.4 ; v1(34.9,6.4) 34.9,5.7 34.3,5.1
  Bottom Layer w0.254: v1(24.6,36.5) 25.1,36.5 v1(26.4,37.8) ; 37.43,6.4 v1(34.9,6.4) ; 37.43,6.4 v1(38.7,6.4) ; 37.43,6.4 42.43,1.4 43.37,1.4 43.46,1.48 57.64,1.48 58.21,0.92 65.24,0.92 65.73,1.4 v1(73.4,1.4) ; v1(39.6,51.9) v1(39.6,43.3)
+20V: length 159
  Top Layer w0.254: 29.55,59.4 29.55,60.58 R40.1 ; 29.55,59.4 29.79,59.4 29.94,59.56 U22.5 ; 29.55,59.4 C87.1 26.5,60.3 26.4,60.4 C81.1 22.95,60.45 22.95,64.17 ; 22.95,64.17 22.97,64.2 v1(24.02,64.2) ; 22.95,64.17 F1.2 ; 52.55,14.25 53.65,14.25 C96.1 ; 52.55,14.25 C91.1 49.1,15.19 49.61,15.7 v1(56.2,15.7) ; 52.55,14.25 54.9,11.9 C90.1 59.17,9.6 U8.5 ; 69.93,32.67 U11.5 68.5,32.47 68.5,28.26 68.33,28.08 C97.1 ; 69.93,32.67 71.1,32.67 72.51,34.08 ; 69.93,32.67 69.9,32.64 69.9,27.45 v1(68.45,26) ; 72.51,34.08 72.51,30.48 72.01,29.98 C94.1 ; 72.51,34.08 73.97,34.08 v1(74.42,34.52) 74.79,34.15 80.4,34.15 C93.1 ; v1(66.5,20.8) 66.5,20.9 v1(67.59,21.99)
  Bottom Layer w0.254: v1(68.45,26) 68.45,25.87 68.4,25.82 68.4,22.8 v1(67.59,21.99) ; v1(56.2,15.7) 61.4,15.7 v1(66.5,20.8) ; v1(24.02,64.2) 32.72,55.5 53.44,55.5 v1(74.42,34.52)
-5V: length 13.8
  Top Layer w0.254: U17.4 13.53,9.92 R22.2 14.86,9.97 C49.2 15.9,11 C100.1 16.9,14.1 16.9,16.1 17.19,16.39 17.19,18.86
GND: length 282.8
  Top Layer w0.254: v1(14.21,95.54) 14.17,95.5 12.61,95.5 ; U23.2 49.36,57.36 v1(48.8,56.8) ; C72.2 32.36,54.67 ; C80.1 27.2,28.77 v1(27.2,28.8) ; v1(97.7,0.8) 97.69,0.78 LED1.2 ; v1(24,46.8) 23.9,46.9 C50.1 ; 18.72,38.75 18.72,37.42 ; 18.72,37.42 19.38,38.08 U20.5 ; 18.72,37.42 v1(18.7,37.4) ; C49.1 v1(18.3,9.8) ; v1(35.8,37.1) 35.1,36.4 C9.2 ; v1(33.9,21.5) 33.9,21.65 34.79,22.54 U1.31 ; C90.2 54.9,8.2 v1(54.9,6.4) ; C100.2 18.2,14 v1(18.2,14.3) ; R16.1 v1(57.8,32.6) 57.5,32.3 55.3,32.3 ; U1.63 45.11,29.04 44.92,29.23 v1(43.21,29.23) ; v1(27.18,18.16) 27.2,18.18 U2.9 ; USBC1.1 10.17,64.97 v1(10.5,65.3) 9.7,66.1 USBC1.B1A12 ; LED2.2 91.91,0.78 v1(92,0.7) ; USBC1.4 v1(8.81,74.74) ; v1(80.6,4.7) C57.1 ; v1(4.5,4.5) 3.8,5.2 C69.1 ; H7.2 2.33,42.53 v1(2.2,42.4) ; USBC2.3 4.8,96.24 v1(4.8,97.9) ; v1(19.7,10.3) 19.8,10.4 19.8,11.5 ; LED4.2 78.62,0.78 v1(78.7,0.7) ; U17.2 13.45,6.53 13.16,6.53 12.99,6.7 U17.9 v1(12.6,8.44) ; C3.1 49.2,21.48 v1(49.18,21.5) ; v1(33.56,28.95) 34.48,28.95 34.53,29.01 35.47,29.01 U1.18 ; v1(19.2,8) 18.9,8.3 C4.1 ; v1(73.8,6.9) 73,6.1 C88.2 ; v1(57.4,0.9) 56.91,1.38 56.45,1.38 ; v1(16.48,45.97) 17.08,45.97 U18.4 ; v1(18.49,70.1) 15,70.1 U7.11 ; U16.2 19.1,53.8 v1(19.6,54.3) ; C101.1 9.6,21 v1(9.3,21) ; LED12.2 17.22,1.09 v1(17.6,0.7) ; U12.2 60.6,25.6 v1(60.7,25.7) ; USBC2.1 9,87.48 v1(9,86.4) ; U4.9 30.75,24.05 v1(30.8,24) 31.4,23.4 C10.1 ; C8.2 30.98,36.1 v1(29.4,36.1) ; v1(43.7,0.9) 43.51,1.09 42.55,1.09 ; v1(50.3,54.1) 50.35,54.15 50.35,55.5 ; U8.1 59.24,18.49 v1(59.24,18.77) 59.35,18.88 R11.1 ; U1.12 39.45,32.95 v1(39.4,33) ; 90.8,4.7 92.21,4.7 v1(92.31,4.8) ; X2.2 30.4,13.9 v1(31.8,15.3) 31.8,16.7 C12.1 ; U18.6 17.9,42.4 v1(17.5,42.8) 17.25,42.55 U18.5 ; C95.2 v1(79.81,46.58) ; v1(13.25,1.77) 13.25,2.63 C67.1 ; C81.2 22.3,56.1 v1(21,56.1) ; C68.1 6.52,2.4 5.3,2.4 v1(5.2,2.5) ; 25.2,20.1 25.4,20.1 25.6,19.9 25.6,18.28 25.59,18.27 25.59,17.51 25.35,17.26 24.58,17.26 U2.4 ; 15.5,16.1 14,14.6 v1(13.8,14.6) 13.8,12.48 R23.1 ; C44.2 v1(25.5,54.3) ; C46.1 v1(18.68,6.1) ; v1(29.9,1) 29.81,1.09 LED10.2 ; U4.4 26.15,23.05 v1(26.2,23.1) ; R1.2 60.2,30.85 v1(60.2,31) 61.5,32.3 U11.1 ; v1(9.1,97.8) 9.1,96.36 USBC2.4 ; v1(18.9,17.1) 19.3,17.1 C13.1 ; v1(77.7,55.4) 77.86,55.56 H6.3 ; LED7.2 50.51,1.09 v1(50.9,0.7) ; v1(85.8,0.7) 85.72,0.78 LED3.2 ; 14.4,54.7 13,54.7 v1(12.9,54.8) ; v1(97.1,22.7) 97,22.6 H5.3 ; v1(15.3,49.3) 13.8,49.3 13.49,48.99 13.49,47.75 R25.1 ; SW2.3 28.4,94.4 v1(28.4,98.18) ; v1(38.9,47.9) 38.8,48 C78.1 ; v1(13.8,64.4) 15.4,66 U7.9 ; v1(10.3,28.12) 10.53,27.9 11.8,27.9 ; 14.9,31.8 14.16,32.54 v1(14.16,33.08) 14.1,33.14 R33.1 ; v1(4.6,63.8) 4.63,63.83 USBC1.2 ; v1(85.3,57.6) 85.2,57.5 H6.1 ; C1.2 55.8,35.6 v1(55.9,35.7) ; 40.4,16.2 v1(40.4,15) ; USBC2.B1A12 10.93,88.67 v1(11,88.6) 12.31,88.6 12.61,88.29 ; C43.2 14.28,52.38 v1(12.81,52.38) ; USBC1.3 4.63,74.75 v1(4.6,74.77) ; v1(75,2.6) 74.9,2.7 C59.1 ; v1(36.9,0.9) 36.72,1.09 LED9.2 ; H4.1 6.22,16.63 v1(8.55,14.3) 10.36,14.3 10.55,14.49 ; v1(37.9,54.7) 37.9,53.36 37.96,53.3 ; v1(22.8,77.7) 22.75,77.75 21.85,77.75 ; C15.2 24.38,12.2 25.36,12.2 v1(25.39,12.16) ; v1(34.67,59.44) 34.55,59.56 U22.2 ; v1(31.2,5.2) 32.8,5.2 32.9,5.1 ; v1(20.3,6.3) 20.3,5.22 C66.1 ; C21.1 26,8.92 v1(26,7.6) ; C17.1 29.3,28.3 v1(28,28.3) ; U19.12 26.05,78.25 v1(25.8,78) ; v1(58.8,60.5) 57.05,58.75 56.4,58.75 ; v1(50.1,5.1) 50.2,5 50.8,5 ; 92.2,15.1 92.5,14.8 v1(92.5,13.1) ; v1(5.3,84.2) 4.7,83.6 D8.2 ; C74.1 34.1,54.26 v1(34.1,54.3) ; D9.2 12.9,83.5 v1(13,83.6) 15.7,83.6 D7.2 ; C85.1 31.98,49.42 v1(31,50.4) ; LED14.2 4.22,1.09 v1(4.6,0.7) ; v1(51.3,19.1) 51.35,19.15 U9.6 ; v1(31,65.82) 31.05,65.78 31.05,64.4 ; v1(54.27,28.7) 52.8,28.7 52.3,29.2 ; H8.2 2.3,37.97 v1(2.2,38.07) ; v1(20.2,34.2) 19.95,34.45 U20.4 ; 34.2,18 v1(34.2,16.57) ; v1(39.72,36.48) 41,35.2 C2.1 ; C87.2 26.5,57.3 v1(25.8,56.6) ; 41.3,58.1 39.8,58.1 v1(39.7,58.2) ; C7.1 v1(47.92,35.2) ; H3.2 5.67,25.2 v1(3.8,25.2) ; D2.2 v1(81.8,41.4) ; C18.1 18.3,29 v1(16.4,29) 16.5,28.9 R3.1 ; C94.2 72.01,24.59 v1(72.1,24.5) ; C93.2 v1(81.4,26.2) ; R24.1 8.98,12.58 v1(9,12.6) ; H1.2 30.94,44.14 v1(31,44.2) ; C77.2 v1(40.8,47.2) ; v1(44.36,18.62) 44.45,18.71 U1.47 ; H5.1 v1(97,13.55) ; 42.9,5 v1(44.7,5) ; v1(71.6,0.8) 71.59,0.78 LED5.2 ; v1(33.6,30.4) 32.42,29.22 C19.2 ; v1(11.6,0.7) 11.22,1.09 LED13.2 ; v1(25.6,84.6) 26.45,83.75 U19.1 ; v1(51,17.7) 50.8,17.5 49.2,17.5 ; 49.1,10.7 v1(49.1,9.04) ; v1(23.6,0.7) 23.22,1.09 LED11.2 ; v1(89.9,28.3) 89.9,30.09 SW1.E ; USBC2.2 v1(4.76,86.4) ; U9.2 55.4,21.2 v1(55.5,21.3) ; v1(19.26,23.7) 20.7,23.7 ; v1(59.3,3.6) 60.9,3.6 D1.2 ; SW1.C 92.5,46.4 v1(92.6,46.5) ; C92.1 v1(22.1,71.7) ; C79.2 39.6,60.4 v1(39.4,60.6) R39.1 ; 52.5,27 v1(54.5,27)
  Bottom Layer w0.254: v1(15.2,27.7) 14.8,28.1 D6.1 ; C51.2 15.3,47.67 v1(15.3,49.3) ; 10.9,48.23 10.43,48.7 v1(9.6,48.7) 9.42,48.52 D5.1 ; v1(11.2,35.1) 13.31,35.1 C53.2 ; R35.1 17.75,29 v1(16.4,29)
  vias: v1(25.04,19.94) v1(32.36,54.67)
$1N585: length 9.4
  Top Layer w0.254: U1.5 43.02,31.56 43.02,32.27 45,34.25 C7.2 45,36.46 X1.2
$1N596: length 9
  Top Layer w0.254: U1.6 42.38,31.56 42.38,32.72 42.2,32.9 42.2,35.1 44.06,36.96 44.06,37.5 42.66,38.9 X1.1
$1N1851: length 26.2
  Top Layer w0.254: H1.5 23.32,41.3 v1(25.1,39.52) ; v1(37.13,34.77) 38.67,34.77 38.82,34.62 38.82,34.13 38.98,33.97 40.17,33.97 41.88,32.27 41.88,31.56 U1.7
  Bottom Layer w0.254: v1(25.1,39.52) 27.68,39.52 28.35,38.84 28.35,35.18 28.53,35 36.9,35 v1(37.13,34.77)
$1N1913: length 21.3
  Top Layer w0.254: v1(55.3,29.5) 55.4,29.4 R1.1 ; U1.60 46.83,27.47 46.12,27.47 45.87,27.22 45.87,26.51 44.9,25.54 v1(44.9,25.2)
  Bottom Layer w0.254: v1(55.3,29.5) 54.4,29.5 54.32,29.58 50.22,29.58 49.88,29.92 49.4,29.92 48.98,29.5 45.57,29.5 43.62,27.54 43.62,26.56 44.9,25.27 v1(44.9,25.2)
$1N2152: length 2.6
  Top Layer w0.254: C11.1 24.5,19.4 U2.1
$1N2458: length 5.8
  Top Layer w0.254: U2.3 23.68,17.68 22.8,16.8 22.8,14.9 24.1,13.6
$1N3323: length 15.8
  Top Layer w0.254: R7.1 21.8,18.65 v1(21.8,17.5) ; v1(30.4,17.66) 30.92,18.18 C12.2 31.71,19.08 31.31,19.48 29.52,19.48 U2.10
  Bottom Layer w0.254: v1(30.4,17.66) 30.24,17.5 v1(21.8,17.5)
$1N3614: length 6.2
  Top Layer w0.254: C16.1 23.2,28.1 23.6,27.7 23.6,24.9 23.95,24.55 U4.1
$1N3615: length 14.6
  Top Layer w0.254: U4.2 24.53,24.13 25.29,24.13 25.53,24.37 25.53,24.72 25.15,25.1 25.15,29.98 L3.1 23.57,29.5 C16.2 20.2,29.5 C18.2
$1N3618: length 2.4
  Top Layer w0.254: U4.3 24.36,23.63 23.6,23.63 23.53,23.7 22.1,23.7
$1N4241: length 13.5
  Top Layer w0.254: 26.8,15.05 26.8,15.78 26.77,15.81 26.77,15.83 26.3,16.3 26.3,20.2 25.9,20.6 25.9,21.9 25.25,22.55 U4.5 ; 26.8,15.05 25.17,16.68 U2.5 ; 26.8,15.05 X2.3
$1N4589: length 6
  Top Layer w0.254: R5.1 14.12,27.95 15.63,26.45 R3.2 16.5,24.34 U25.6
$1N4663: length 4.3
  Top Layer w0.254: U25.5 19.63,26.2 R4.2
$1N4714: length 14.4
  Top Layer w0.254: 14.65,25.18 U25.7 ; 14.65,25.18 15.08,25.18 v1(15.4,25.5) ; 14.65,25.18 14.65,25.9 R5.2 ; v1(7.8,27.2) 7.13,27.87 H3.1
  Bottom Layer w0.254: v1(15.4,25.5) 13.7,27.2 11.78,27.2 11.78,27.2 v1(7.8,27.2)
$1N4922: length 8.5
  Top Layer w0.254: R8.1 10.4,16 13.5,16 14.5,17 14.5,18.71 14.65,18.86
$1N4931: length 7.8
  Top Layer w0.254: H4.2 10.02,19.17 R8.2 12.69,19.55 13.38,18.86
$1N5138: length 12.5
  Top Layer w0.254: U2.2 23.58,18.18 23.52,18.12 ; 23.52,18.12 23.28,18.12 23.1,18.3 23.1,19.4 C11.2 ; 23.52,18.12 C13.2 21.9,15.9 L2.1 21.53,12.9 19.8,12.9
$1N5202: length 22.4
  Top Layer w0.254: U2.8 29.46,17.68 29.54,17.76 29.57,17.76 29.81,18.01 29.81,18.04 v1(30.2,18.42) ; v1(41.9,13.97) 41.9,17.46 39.95,19.41 U1.38
  Bottom Layer w0.254: v1(30.2,18.42) 30.61,18.42 30.98,18.05 30.98,17.82 34.83,13.97 v1(41.9,13.97)
$1N5230: length 12.8
  Top Layer w0.254: v1(27.8,26.2) 28.4,26.8 C17.2 29.4,25.28 U4.10 ; v1(21.25,25.1) 21.95,25.8 R4.1
  Bottom Layer w0.254: v1(27.8,26.2) 26.7,25.1 v1(21.25,25.1)
$1N5240: length 20.8
  Top Layer w0.254: v1(34.29,27.1) 34.35,27.1 34.72,27.47 35.43,27.47 U1.21 ; v1(30.2,16.9) 29.92,17.18 U2.7 ; U4.7 30.05,23.05 v1(30.1,23.1)
  Inner1 w0.254: v1(34.29,27.1) 32.2,27.1 32,26.9 31.3,26.9 30.1,25.7 v1(30.1,23.1) 29.4,23.1 28.68,22.38 28.36,22.38 28.02,22.04 28.02,21.72 27.5,21.2 27.5,19.6 v1(30.2,16.9)
$1N5277: length 18.4
  Top Layer w0.254: U4.8 27.15,23.55 v1(27.1,23.6) ; v1(39.5,23.3) 39.5,20.16 U1.37
  Bottom Layer w0.254: v1(39.5,23.3) 37.4,23.3 37.12,23.02 32.61,23.02 31.04,24.58 30.28,24.58 29.3,23.6 v1(27.1,23.6)
$1N6288: length 10.1
  Top Layer w0.254: R9.2 20.29,69.25 20.29,69.37 20.7,69.77 C92.2 19.9,72.5 U7.1
$1N6673: length 35.3
  Top Layer w0.254: 68.1,11.6 68.1,7.2 C88.1 ; 68.1,11.6 U8.6 ; 68.1,11.6 64.1,7.6 D1.1 ; U8.3 69.95,14.08 U8.6 ; U8.6 77.81,13.76 U15.2
$1N6894: length 5.9
  Top Layer w0.254: U8.4 60.19,12.32 58.08,12.32 56.2,14.2 55.1,14.2
$1N7290: length 11.8
  Top Layer w0.254: U8.2 61.12,15.78 62.13,16.79 62.13,18.17 60.85,19.45 R11.2 61.05,20.4 R12.2 R10.1
$1N7531: length 6.5
  Top Layer w0.254: U9.1 57.2,20.25 R12.1
$1N7563: length 21.4
  Top Layer w0.254: R45.1 48.65,30.7 48.65,29.75 47.93,29.03 47.93,28.86 47.68,28.61 46.97,28.61 U1.62 45.44,28.54 v1(45.1,28.2) ; v1(50.15,23.15) 50.42,22.88 50.42,22.76 50.76,22.42 50.88,22.42 51.15,22.15 U9.4 55.75,26.55 U12.4
  Bottom Layer w0.254: v1(50.15,23.15) v1(45.1,28.2)
$1N8313: length 4.8
  Top Layer w0.254: U11.4 66.61,28.68 C97.2
$1N8343: length 40.1
  Top Layer w0.254: L14.2 75.1,50.91 D2.1 ; C95.1 76.31,42.61 D2.1 ; D2.1 73.81,42.69 U11.6 65.22,32.99 U11.3
$1N8365: length 4.6
  Top Layer w0.254: R17.1 62.2,27.03 62.2,26 61.22,25.02 59.82,25.02 U12.1
$1N14166: length 4.3
  Top Layer w0.254: C47.1 7.96,6.94 8.87,6.03 11.59,6.03 U17.8
$1N14170: length 2.7
  Top Layer w0.254: U17.7 11.66,6.44 10.69,6.44 10.59,6.55 9.6,6.55 C47.2
$1N14199: length 2.9
  Top Layer w0.254: U17.3 14.55,6.95 C4.2
$1N14425: length 4.8
  Top Layer w0.254: R23.2 11.98,11.98 R22.1 11.98,7.76 U17.5
$1N14703: length 17.2
  Top Layer w0.254: R15.1 57.8,39.83 R16.2 62.15,35.55 63.2,34.5 U11.2 63.2,29.93 R17.2
$1N14730: length 20.8
  Top Layer w0.254: v1(34.2,26.3) 34.56,26.3 34.72,26.47 35.43,26.47 U1.23 ; v1(28.79,15.96) 28.79,16.62 U2.6 ; v1(28.6,21.8) 28.66,21.86 U4.6
  Inner1 w0.254: v1(34.2,26.3) 31.7,26.3 31.38,25.98 31.38,23.76 30.68,23.06 30.68,22.86 29.73,21.9 28.7,21.9 v1(28.6,21.8) 28.8,21.8 30.98,19.62 30.98,16.18 30.76,15.96 v1(28.79,15.96)
$1N14753: length 25.7
  Top Layer w0.254: v1(50.19,21.19) 51.34,21.19 U9.5 ; 51.35,21.37 51.55,21.57 52.02,21.57 52.18,21.73 52.18,22.2 55.58,25.6 U12.5 ; v1(44.65,27.5) 45.3,27.5 45.8,28 46.72,28 46.76,28.04 U1.61 47.49,28.04 47.56,28.11 48.11,28.11 49.06,29.05 49.06,29.6 R44.1
  Bottom Layer w0.254: v1(44.65,27.5) 50.19,21.96 v1(50.19,21.19)
$1N18725: length 8
  Top Layer w0.254: R26.1 15.25,45.71 R25.2 17.52,47.5 18.36,46.66 18.36,45.99 U18.2
$1N18813: length 16.8
  Top Layer w0.254: U18.3 17.9,44.37 v1(17.81,44.28)
  Bottom Layer w0.254: 15.2,44.28 v1(17.81,44.28) ; D5.3 10.05,47.57 R28.2 10.9,43.85 R29.2 11.28,43.47 14.19,43.47 15.1,44.38 C51.1
$1N21926: length 84.2
  Top Layer w0.254: v1(44.9,24.2) 45.4,24.7 45.4,24.87 45.48,24.96 45.48,25.33 46.12,25.97 46.67,25.97 46.74,26.04 U1.57 ; U19.5 24.95,81.75 v1(24.8,81.9)
  Inner1 w0.254: v1(44.9,24.2) 44.83,24.2 30.53,38.5 24,38.5 21.5,41 21.5,42.7 24.27,45.47 27.27,45.47 27.27,70.16 24.3,73.13 24.3,81.4 v1(24.8,81.9)
$1N21936: length 84.1
  Top Layer w0.254: v1(25.7,82.33) 26.37,82.33 26.38,82.32 28.93,82.32 U19.4 ; U1.55 46.34,25.04 46.27,24.97 46.12,24.97 45.87,24.72 45.87,24.27 45.8,24.2 45.8,23.8 v1(45,23)
  Inner1 w0.254: v1(45,23) 45.3,23 50.69,28.39 49.08,30 44.6,30 36.8,37.8 36.8,41.8 34.44,44.16 33.34,44.16 28.88,48.62 28.88,67.89 29.18,67.89 29.39,68.1 29.39,71.01 28.4,72 26.8,72 25.7,73.1 25.7,76.94 25.66,76.94 25.07,77.53 25.07,80.67 25.7,81.3 v1(25.7,82.33)
$1N21977: length 130.8
  Top Layer w0.254: v1(33.5,24.6) 34.44,24.6 34.47,24.57 34.47,23.86 34.72,23.61 35.43,23.61 U1.29 ; U19.3 26.46,82.75 26.29,82.91 25.95,82.91 25.94,82.92 25.46,82.92 25.45,82.91 24.53,82.91 v1(24.47,82.97)
  Bottom Layer w0.254: v1(24.47,82.97) 24.17,82.67 24.17,82.6 23.92,82.34 23.92,81.86 24.26,81.52 24.36,81.52 24.56,81.32 25.04,81.32 25.24,81.52 25.43,81.52 50.13,56.82 58.46,56.82 58.66,56.62 58.8,56.62 69.9,45.52 69.9,40.1 75.2,34.8 75.2,33.9 75.04,33.74 55.27,33.74 55.24,33.72 54.11,33.72 53.14,34.68 49.45,34.68 48.53,33.76 41.65,33.76 39.24,31.35 39.24,30.44 34.9,26.1 34.83,26.1 33.5,24.77 v1(33.5,24.6)
$1N22025: length 145.5
  Top Layer w0.254: v1(38.1,18.7) 37.45,19.35 U1.33 ; U19.2 28.93,83.32 26.18,83.32 25.55,83.95 v1(24.6,83.95)
  Bottom Layer w0.254: v1(24.6,83.95) 25.63,82.92 25.94,82.92 26.28,82.58 26.28,82.27 50.6,57.95 50.6,57.7 50.78,57.52 57.22,57.52 58.5,58.8 66.1,58.8 72.7,52.2 72.7,41.9 73,41.6 73,39.73 73.18,39.54 73.18,39.06 73,38.87 73,38.4 75.98,35.42 75.98,33.48 75.68,33.18 50.64,33.18 50.04,33.78 49.56,33.78 48.97,33.2 42.1,33.2 39.9,31 39.9,26.7 44,22.6 44,20.83 41.87,18.7 v1(38.1,18.7)
$1N22161: length 32.2
  Top Layer w0.254: v1(35.5,32) 36.01,31.49 U1.16 ; v1(29.04,31.29) 28.66,31.67 28.66,34.54 23.91,39.29 20.91,39.29 19.8,40.4 19.41,40.4 19.39,40.38 19.01,40.38 18.74,40.65 18.74,41.32 U18.7 18.55,40.84 18.09,40.38 16.56,40.38 R26.2
  Bottom Layer w0.254: v1(35.5,32) 35.4,31.9 35.27,31.9 34.66,31.29 v1(29.04,31.29)
$1N22287: length 49.5
  Top Layer w0.254: U1.15 38,31.54 v1(38,32.9) ; R31.2 v1(29.5,73.5) ; v1(35.3,54.8) v1(35.3,56.7)
  Bottom Layer w0.254: v1(35.3,56.7) 35.3,67.7 v1(29.5,73.5) ; v1(38,32.9) 38.8,33.7 38.8,41.2 32.9,47.1 32.9,51.6 35.3,54 v1(35.3,54.8)
$1N22291: length 8.6
  Top Layer w0.254: 19.95,77.75 21.6,76.1 24.15,76.1 R31.1
$1N22318: length 10.9
  Top Layer w0.254: U19.11 28.97,78.72 23.58,78.72 23.4,78.9 23.4,82 23.2,82.2 23.2,82.65 R32.2
$1N22321: length 2.6
  Top Layer w0.254: 20.9,80.05 22.2,81.35 R32.1
$1N22726: length 30.5
  Top Layer w0.254: U1.17 35,30.04 v1(35,30.8) ; 18.08,39.9 18,39.98 16.39,39.98 16.32,40.05 R34.2 ; 18.08,39.9 18.15,39.97 19.57,39.97 20.74,38.8 23.4,38.8 27.5,34.7 27.5,31.9 29,30.4 v1(29,30.3) ; 18.08,39.9 U20.7
  Bottom Layer w0.254: v1(29,30.3) 30.2,29.1 31.6,29.1 32.08,29.58 33.78,29.58 v1(35,30.8)
$1N22732: length 7.5
  Top Layer w0.254: R34.1 R33.2 17.04,36.15 17.89,35.31 17.89,34.64 U20.2
$1N22733: length 20.5
  Top Layer w0.254: 18.72,34.45 18.7,34.48 v1(18.7,36.1)
  Bottom Layer w0.254: v1(18.7,36.1) 17.8,35.2 C53.1 18.8,32.99 R35.2 17.35,30.1 D6.3 12.68,30.1 R36.2
$1N22742: length 4
  Top Layer w0.254: H8.1 3.97,33.63 v1(4.2,33.4)
  Bottom Layer w0.254: v1(4.2,33.4) 5.82,33.4 R36.1
$1N26018: length 91.7
  Top Layer w0.254: R37.1 97.55,6.1 75.5,6.1 73.6,4.2 63.8,4.2 63.55,3.95 63.55,2.65 62.62,1.72 59.78,1.72 56.8,4.7 54.7,4.7 51.9,7.5 37.2,7.5 37.02,7.68 37.02,28.22 38.45,29.65 U1.14
$1N26022: length 3.2
  Top Layer w0.254: R37.2 97.25,2.62 96.35,2.62
$1N26280: length 5.7
  Top Layer w0.254: 90.35,2.62 93.42,2.62 LED1.1
$1N26466: length 5.7
  Top Layer w0.254: 84.35,2.62 87.42,2.62 LED2.1
$1N26583: length 6.7
  Top Layer w0.254: LED3.1 81.42,2.62 77.35,2.62
$1N26700: length 6.7
  Top Layer w0.254: 70.35,2.62 71.48,1.48 72.04,1.48 72.71,0.81 73.92,0.81 73.95,0.78 LED4.1
$1N26817: length 13.8
  Top Layer w0.254: LED6.3 58.88,0.78 LED5.1
$1N26936: length 6.5
  Top Layer w0.254: 55.35,1.38 53.81,1.38 52.25,2.95 49.59,2.95 LED7.3
$1N30201: length 6.7
  Top Layer w0.254: LED9.3 36.45,2.01 38.42,2.01 39.35,1.09 41.45,1.09
$1N30205: length 6.7
  Top Layer w0.254: LED10.3 32.62,2.91 LED9.1
$1N30209: length 5.7
  Top Layer w0.254: LED10.1 24.38,1.09 LED11.3
$1N30213: length 5.7
  Top Layer w0.254: LED12.3 18.38,1.09 LED11.1
$1N30937: length 5.7
  Top Layer w0.254: LED12.1 12.38,1.09 LED13.3
$1N30941: length 6.7
  Top Layer w0.254: LED14.3 5.38,1.09 LED13.1
$1N34226: length 2.5
  Top Layer w0.254: 32.92,56.3 33.48,56.86 U22.1
$1N34610: length 5.9
  Top Layer w0.254: U22.3 36.37,60.51 R39.2 36.46,57.9 R38.1
$1N34796: length 10.1
  Top Layer w0.254: L16.1 27.1,52.17 27.1,54.4 29,56.3 31.52,56.3 31.52,57.87 U22.6
$1N34941: length 4.6
  Top Layer w0.254: U22.4 32.55,62.28 32.55,64.4
$1N35020: length 28.5
  Top Layer w0.254: U1.52 46.83,23.47 46.12,23.47 45.87,23.22 45.87,22.51 45.66,22.3 45.2,22.3 45.08,22.42 44.76,22.42 38.95,28.22 U1.13 38.88,31.56 38.88,32.27 38.58,32.56 38.58,33.14 38.24,33.48 36.95,33.48 35.44,35 C9.1 31,35 32.77,33.23 32.77,32.1 L1.1
$1N39030: length 45.6
  Top Layer w0.254: v1(25.8,44.4) 25.86,44.34 H1.4 ; v1(42.1,23.5) 42.92,22.68 43.64,22.68 43.98,22.34 43.98,21.86 43.95,21.82 U1.46
  Bottom Layer w0.254: v1(42.1,23.5) 41.4,24.2 33.93,24.2 33.74,24.02 33.26,24.02 32.92,24.36 32.92,24.78 32.6,25.1 32.6,27.2 31.5,28.3 30.17,28.3 28.35,30.12 28.35,31.44 25.28,34.52 25.28,34.64 24.94,34.98 24.82,34.98 22.1,37.7 22.1,40.9 22.19,40.99 22.19,43.82 22.96,44.58 23.44,44.58 23.63,44.4 v1(25.8,44.4)
$1N39037: length 32.4
  Top Layer w0.254: H1.3 30.69,39.71 v1(30.8,39.71) ; v1(43.8,24.4) 42.7,25.5 v1(42.7,27.7) ; U1.49 46.97,22.11 48.19,22.11 v1(48.2,22.1)
  Inner1 w0.254: v1(42.7,27.7) 42.7,28.81 38.82,32.7 38.82,33.91 37.37,35.35 35.65,35.35 31.4,39.6 30.91,39.6 v1(30.8,39.71)
  Bottom Layer w0.254: v1(48.2,22.1) 48.2,22.8 47.42,23.58 44.62,23.58 v1(43.8,24.4)
$1N45861: length 18.5
  Top Layer w0.254: D8.1 6.3,76.1 6.3,73.13 8.88,70.55 USBC1.A5 9.64,70.48 10.34,70.48 10.7,70.12 10.7,67.88 11.05,67.53 12.82,67.53 13.4,66.94 U7.7
$1N45870: length 29.2
  Top Layer w0.254: USBC1.B5 7.17,67.55 6.87,67.25 6.87,65.27 8.64,63.5 9.53,63.5 11.83,65.81 11.83,66.5 12.01,66.68 12.4,66.68 ; D7.1 16,78.7 v1(16,77) ; U7.6 v1(12.4,65.2)
  Bottom Layer w0.254: v1(12.4,65.2) 16,68.8 v1(16,77)
$1N47534: length 3.7
  Top Layer w0.254: H7.1 v1(6.6,44.3)
  Bottom Layer w0.254: R29.1 7.49,44.3 v1(6.6,44.3)
$1N51078: length 34.3
  Top Layer w0.254: D9.1 9.7,75 10.5,74.2 10.5,72.08 10.34,71.92 9.7,71.92 9.7,71.7 USBC1.A4B9 9.8,71.48 10.34,71.48 11.3,70.52 11.3,67.97 12.95,67.97 13.03,67.89 14.23,67.89 14.4,67.72 U7.8 14.82,66.92 14.82,67.37 14.98,67.53 16.82,67.53 17.5,66.85 R9.1 20.52,66.85 20.7,67.03 20.7,69.2 21.4,69.9 24.35,69.9 F1.1
$1N51620: length 3.3
  Top Layer w0.254: U23.1 47.96,58.5 45.26,58.5
$1N51622: length 5.6
  Top Layer w0.254: U23.3 50.31,56.96 48.85,55.5 48.75,55.6 46.45,55.6
$1N51629: length 19.6
  Top Layer w0.254: 45.26,59.9 46.11,60.75 U23.6 48.26,60.6 49.57,59.3 50.3,59.3 51.7,57.9 51.7,52.6 49.8,50.7 L15.1
$1N59316: length 2.9
  Top Layer w0.254: C10.2 33.27,22.97 35.43,22.97 U1.30
$1N79865: length 3
  Top Layer w0.254: USBC2.B5 12.3,90.12 12.61,89.8
$1N79871: length 3.3
  Top Layer w0.254: USBC2.A5 11.74,93.12 12.61,93.99
$1N84112: length 6.1
  Top Layer w0.254: 15.92,18.86 15.92,19.72 16.5,20.3 18.65,20.3 R7.2
$1N88101: length 106.9
  Top Layer w0.254: 11.25,91.73 10.63,92.34 10.63,92.38 10.4,92.62 9.7,92.62 ; 11.25,91.73 10.51,91.73 10.47,91.69 9.78,91.69 9.7,91.62 ; 11.25,91.73 v1(11.29,91.69) ; v1(42.8,18.8) 42.8,19.25 42.88,19.33 42.88,20.04 U1.44
  Bottom Layer w0.254: v1(11.29,91.69) 11.29,91.59 17.3,85.57 17.3,84.23 17.48,84.05 18.02,84.05 18.4,83.67 18.4,83.1 18.01,82.71 17.66,82.71 17.3,82.35 17.3,60.3 16.24,59.24 16.24,47.04 17.06,46.22 17.06,45.86 18.82,44.1 19.18,44.1 19.34,43.94 19.34,43.06 19.4,43 20.4,43 20.9,42.5 20.9,27.1 20.2,26.4 20.2,21.7 20.38,21.52 23.45,21.52 23.86,21.12 24.68,21.12 25.48,20.32 26.72,20.32 26.97,20.06 35.74,20.06 37.68,18.12 37.9,18.12 37.97,18.05 39.42,18.05 39.56,18.18 40.04,18.18 40.18,18.05 41.85,18.05 42.5,18.7 42.7,18.7 v1(42.8,18.8)
$1N88141: length 107.5
  Top Layer w0.254: U1.45 43.4,20.16 v1(43.4,22.1) ; v1(11.1,90.9) 10.88,91.12 USBC2.B6 9.63,91.19 8.94,91.19 8.78,91.35 8.78,91.88 8.94,92.05 9.56,92.05 9.61,92.09 9.68,92.09 USBC2.A6
  Bottom Layer w0.254: v1(11.1,90.9) 10.7,91.3 10.7,91.93 11.04,92.27 11.53,92.27 20.13,83.67 20.13,79.42 20.05,79.34 20.05,71 20.13,70.92 20.13,55.65 19.02,54.54 19.02,54.06 18.52,53.56 18.52,47.76 19.17,47.1 19.6,47.1 19.8,46.9 20.3,46.9 21.5,45.7 21.5,27.1 20.7,26.3 20.7,25.38 20.67,25.34 20.67,24.86 20.7,24.82 20.7,22.5 20.88,22.32 23.79,22.32 23.86,22.38 24.34,22.38 24.41,22.32 25.72,22.32 25.9,22.5 43,22.5 v1(43.4,22.1)
$1N102107: length 5.1
  Top Layer w0.254: R15.2 56.51,42.63 R48.1
$1N102112: length 41.5
  Top Layer w0.254: L14.1 61.88,53.08 56.61,53.08 ; H6.2 80.4,59.1 79.2,60.3 61.75,60.3 C83.1 56.6,53.09 56.61,53.08 ; 56.61,53.08 56.61,48.33 R48.2
$1N102197: length 5.9
  Top Layer w0.254: R50.2 38.95,4.22 41.27,1.9 42.1,1.9 42.65,2.45 LED8.3
$1N102205: length 21.5
  Top Layer w0.254: R50.1 36.6,5.65 36.6,24.6 36.53,24.67 36.53,24.72 36.28,24.97 36.23,24.97 36.16,25.04 U1.26
$1N106263: length 6.2
  Top Layer w0.254: R51.1 85.65,21.2 R49.2
$1N106296: length 17.7
  Top Layer w0.254: R51.2 89.9,21 92.2,18.7 ; 92.2,18.7 96.4,18.7 H5.2 ; 92.2,18.7 87.48,13.98 U15.1
$1N106370: length 5.2
  Top Layer w0.254: R10.2 69.05,22.6 R52.1
$1N106372: length 6.4
  Top Layer w0.254: R49.1 71.95,21.2 R52.2
$1N114591: length 73.8
  Top Layer w0.254: SW1.D v1(95.04,28.21) ; U1.36 39,20.06 39,16.2 39.8,17 v1(39.8,17.6)
  Bottom Layer w0.254: v1(95.04,28.21) 95.04,27.71 95.74,27.01 95.74,21.53 95.49,21.27 66.85,21.27 66.6,21.53 59.7,21.53 54.6,16.42 42.6,16.42 42.34,16.68 41.86,16.68 41.6,16.42 40.48,16.42 39.8,17.1 v1(39.8,17.6)
$1N114599: length 60.4
  Top Layer w0.254: v1(51.4,25.6) 51.1,25.9 51.1,27 49.7,27 49.24,26.54 U1.58 ; SW1.A v1(95.04,46.38)
  Bottom Layer w0.254: v1(95.04,46.38) 93.8,45.14 93.8,44.28 92.12,42.6 87.6,42.6 73.57,28.57 55.87,28.57 55.3,28 54.27,28 51.87,25.6 v1(51.4,25.6)
$1N114607: length 54.2
  Top Layer w0.254: v1(90,46.6) 89.96,46.56 SW1.B ; v1(53.9,30.76) 52.46,30.76 48.74,27.04 U1.59
  Bottom Layer w0.254: v1(53.9,30.76) 59.62,30.76 59.96,30.42 73.49,30.42 76.39,33.31 76.39,34 89.44,47.06 89.54,47.06 v1(90,46.6)
$1N131496: length 19.1
  Top Layer w0.254: SW2.2 26.3,87.3 23.7,84.7 23.7,82.66 24,82.36 24,81.55 24.25,81.3 28.95,81.3 U19.6

## Copper pours and planes (outline as drawn; the poured copper is in the pictures)
+3.3V on Inner2: 0.3,99.25 100.1,99.25 100.1,0.1 0.3,0.1
GND on Top Layer: 0,100 100,100 100,0.2 0,0.2
GND on Inner1: 0,99.6 100,99.6 100,0 0,0
